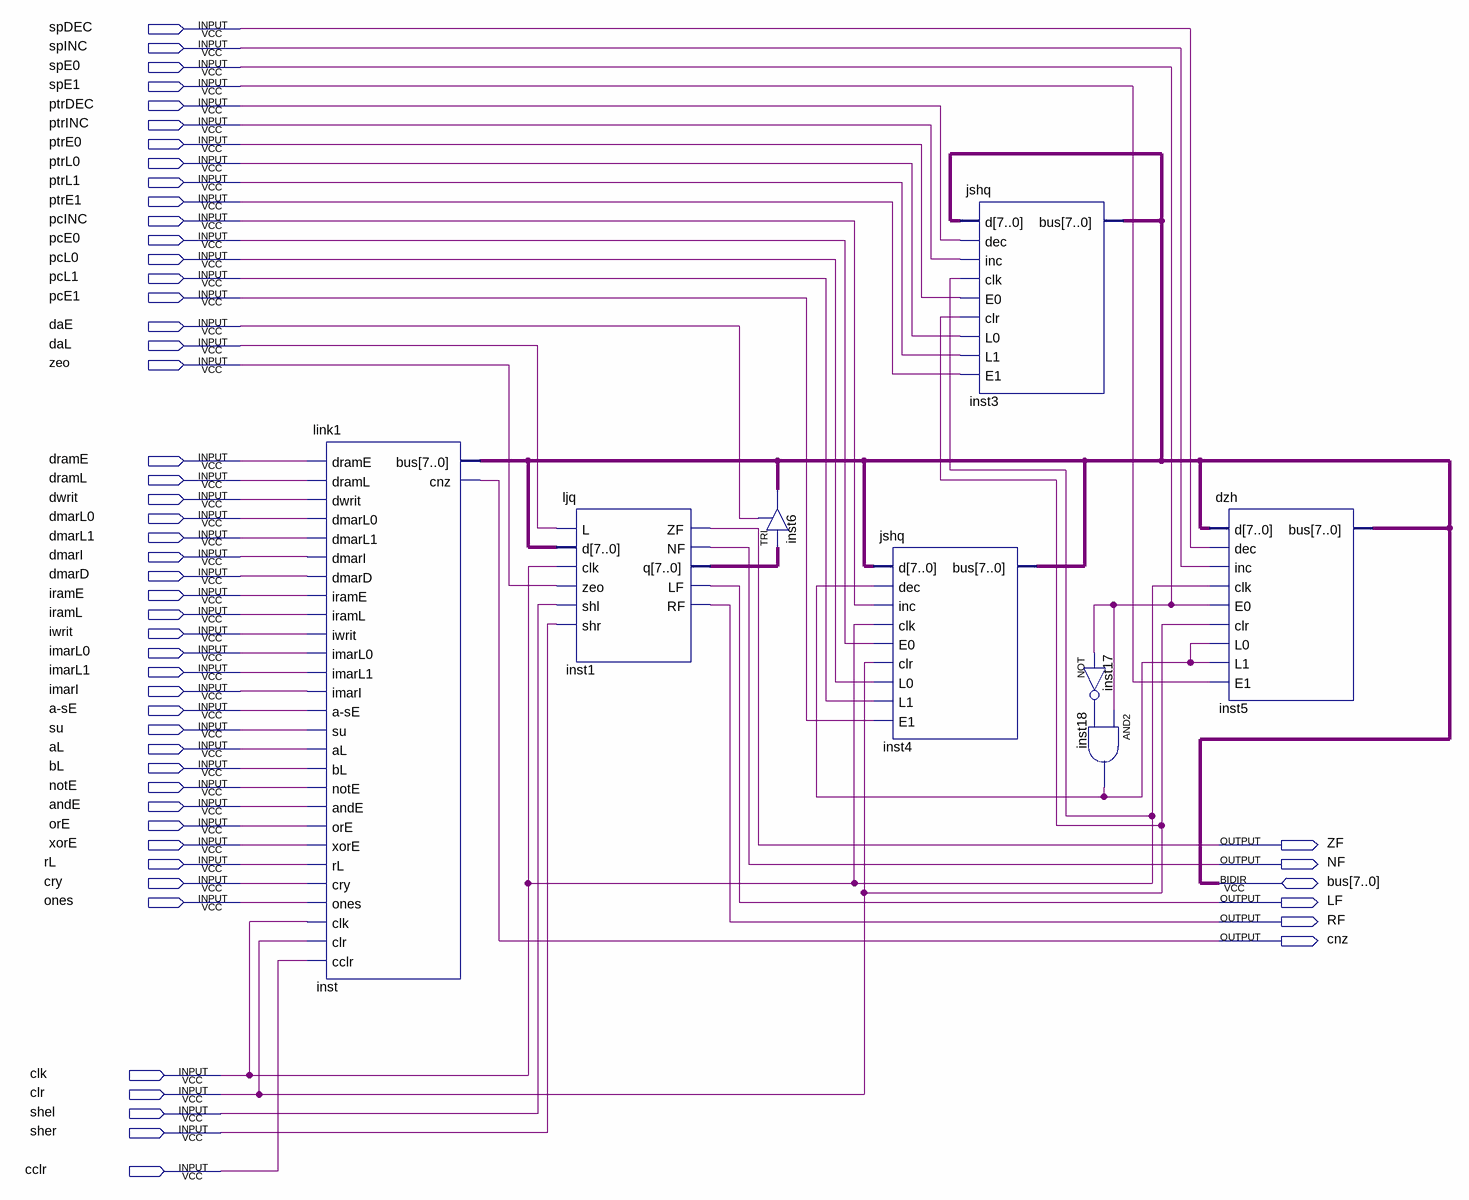
[diagram p0: schematic sheet]
// Quartus schematic link2.bdf as structural Verilog: 8 symbols, 53 pins
module link2 (
  input  spDEC,
  input  spINC,
  input  spE0,
  input  spE1,
  input  ptrDEC,
  input  ptrINC,
  input  ptrE0,
  input  ptrL0,
  input  ptrL1,
  input  ptrE1,
  input  pcINC,
  input  pcE0,
  input  pcL0,
  input  pcL1,
  input  pcE1,
  input  daE,
  input  daL,
  input  zeo,
  input  dramE,
  input  dramL,
  input  dwrit,
  input  dmarL0,
  input  dmarL1,
  input  dmarI,
  input  dmarD,
  input  iramE,
  input  iramL,
  input  iwrit,
  input  imarL0,
  input  imarL1,
  input  imarI,
  input  \a-sE ,
  input  su,
  input  aL,
  input  bL,
  input  notE,
  input  andE,
  input  orE,
  input  xorE,
  input  rL,
  input  cry,
  input  ones,
  input  clk,
  input  clr,
  input  shel,
  input  sher,
  input  cclr,
  inout  [7:0] bus,
  output ZF,
  output NF,
  output LF,
  output RF,
  output cnz
);

  wire inst17_out, inst18_out;
  wire [7:0] inst1_q;

  link1 inst (
    .dramE(dramE), .dramL(dramL), .dwrit(dwrit), .dmarL0(dmarL0), .dmarL1(dmarL1), .dmarI(dmarI),
    .dmarD(dmarD), .iramE(iramE), .iramL(iramL), .iwrit(iwrit), .imarL0(imarL0), .imarL1(imarL1),
    .imarI(imarI), .\a-sE (\a-sE ), .su(su), .aL(aL), .bL(bL), .notE(notE), .andE(andE), .orE(orE),
    .xorE(xorE), .rL(rL), .cry(cry), .ones(ones), .clk(clk), .clr(clr), .cclr(cclr), .cnz(cnz), .bus(bus));
  ljq inst1 (
    .L(daL), .d(bus), .clk(clk), .zeo(zeo), .shl(shel), .shr(sher), .ZF(ZF), .NF(NF), .q(inst1_q), .LF(LF),
    .RF(RF));
  TRI inst6[7:0] (.IN(inst1_q), .OE(daE), .OUT(bus));
  jshq inst4 (
    .d(bus), .dec(inst18_out), .inc(pcINC), .clk(clk), .E0(pcE0), .clr(clr), .L0(pcL0), .L1(pcL1), .E1(pcE1),
    .bus(bus));
  jshq inst3 (
    .d(bus), .dec(ptrDEC), .inc(ptrINC), .clk(clk), .E0(ptrE0), .clr(clr), .L0(ptrL0), .L1(ptrL1),
    .E1(ptrE1), .bus(bus));
  not inst17 (inst17_out, spE0);
  and inst18 (inst18_out, spE0, inst17_out);
  dzh inst5 (
    .d(bus), .dec(spDEC), .inc(spINC), .clk(clk), .E0(spE0), .clr(clr), .L0(inst18_out), .L1(inst18_out),
    .E1(spE1), .bus(bus));
endmodule
